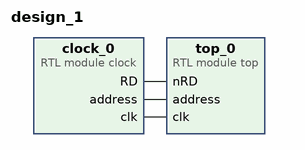
[diagram p0: block diagram of the top level]
# Vivado block design design_1, xc7s25csga324-1, Vivado 2021.2
create_bd_design design_1

create_bd_cell -type module -reference clock clock_0
create_bd_cell -type module -reference top top_0

# ---- connections ----

connect_bd_net [get_bd_pins clock_0/RD] [get_bd_pins top_0/nRD]
connect_bd_net [get_bd_pins clock_0/address] [get_bd_pins top_0/address]
connect_bd_net [get_bd_pins clock_0/clk] [get_bd_pins top_0/clk]

validate_bd_design
save_bd_design
